# Altium schematic sheet 03-Power_3v3.SchDoc: ECE453 Power
size A; Date: 4/25/2017; ApprovedBy: JSK; CheckedBy: JSK; Author: JSK; CompanyName: University of Wisconsin; DrawnBy: JSK; Engineer: JSK; Organization: ECE 315; Address1: College of Engineering; Address2: 1415 Engineering Drive; Address3: Madison, WI 53706; Address4: ECE 453 Fall 2022; Revision: A; SheetNumber: 2; SheetTotal: 8; AssemblyNumber: ECE453-F22-01
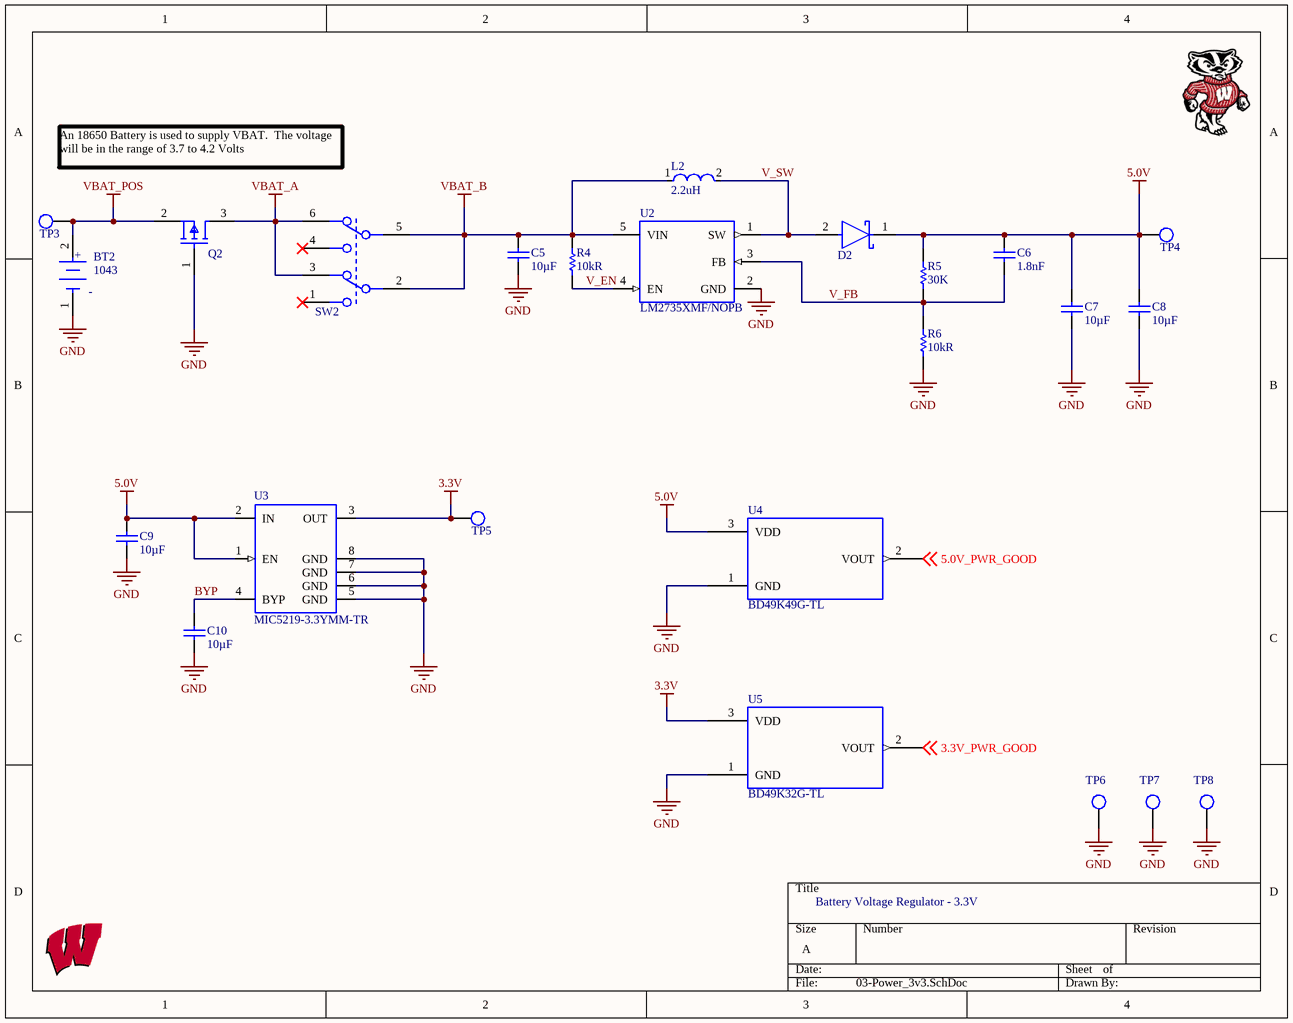
[diagram p0: 03-Power_3v3.SchDoc]

## Parts
BT2  1043  [Keystone_1043_0]
C5  value 10µF  [CAP_0805]  (hidden comment: CAP_0805_U_010_00)
C6  Capacitance: 1.8nF  [CAP_0805]  (hidden comment: CAP_0805_N_001_80)
C7  value 10µF  [CAP_0805]  (hidden comment: CAP_0805_U_010_00)
C8  value 10µF  [CAP_0805]  (hidden comment: CAP_0805_U_010_00)
C9  value 10µF  [CAP_0805]  (hidden comment: CAP_0805_U_010_00)
C10  value 10µF  [CAP_0805]  (hidden comment: CAP_0805_U_010_00)
D2  SM5817PL-TP  [On_Semiconductor_425-04_IPC_A]  (value not drawn)
L2  Inductance: 2.2uH  [IND_TAIYO_NRS4018_TAY]  (hidden comment: NRS4018T2R2MDGJ)
Q2  SSM3J328R,LF  [SOT-23_M]  (value not drawn)
R4  Resistance: 10kR  [RES_0805]  (hidden comment: RES_0805_K_010.00)
R5  30K  [RES_0805]
R6  Resistance: 10kR  [RES_0805]  (hidden comment: RES_0805_K_010.00)
SW2  JS202011SCQN  [C&K_Components_0_MFG]  (value not drawn)
TP3  TP_1206  [TP-SMC-1206]  (value not drawn)
TP4  TP_1206  [TP-SMC-1206]  (value not drawn)
TP5  TP_1206  [TP-SMC-1206]  (value not drawn)
TP6  TP_1206  [TP-SMC-1206]  (value not drawn)
TP7  TP_1206  [TP-SMC-1206]  (value not drawn)
TP8  TP_1206  [TP-SMC-1206]  (value not drawn)
U2  Manufacturer Part Number 1: LM2735XMF/NOPB  [Texas_Instruments_DBV0005A_0]  (hidden comment: LM2735XMF-NOPB)
U3  MIC5219-3.3YMM-TR  [MIC5219-3.3YMM-TR]
U4  BD49K49G-TL  [ROHM-SSOP3_ROM-M]
U5  BD49K32G-TL  [ROHM-SSOP3_ROM-M]

## Nets
3.3V: TP5.1 U3.3(OUT) U5.3(VDD)
5.0V: C6.2 C7.2 C8.2 C9.2 D2.1(C) R5.2 TP4.1 U3.1(EN) U3.2(IN) U4.3(VDD)
GND: BT2.1(C) C5.1 C7.1 C8.1 C9.1 C10.1 Q2.1(Gate) R6.1 TP6.1 TP7.1 TP8.1 U2.2(GND) U3.5(GND) U3.6(GND) U3.7(GND) U3.8(GND) U4.1(GND) U5.1(GND)
VBAT_A: Q2.3(Drain) SW2.3 SW2.6
VBAT_B: C5.2 L2.1 R4.2 SW2.2 SW2.5 U2.5(VIN)
VBAT_POS: BT2.2(A) Q2.2(Source) TP3.1
3.3V_PWR_GOOD: U5.2(VOUT) ; off-sheet 3.3V_PWR_GOOD
5.0V_PWR_GOOD: U4.2(VOUT) ; off-sheet 5.0V_PWR_GOOD
BYP: C10.2 U3.4(BYP)
V_EN: R4.1 U2.4(EN)
V_FB: C6.1 R5.1 R6.2 U2.3(FB)
V_SW: D2.2(A) L2.2 U2.1(SW)

Not connected (* = marked no-connect by the designer): SW2 1* 4*

## Notes on the sheet
- An 18650 Battery is used to supply VBAT.  The voltage will be in the range of 3.7 to 4.2 Volts
- Battery Voltage Regulator - 3.3V
- (in symbol 1043) +; -

## Library data of the parts
BT2 = 1043: Cylindrical Battery Contacts, Clips, Holders & Springs 18650 PCB PLASTIC BATT HLDR THM 1 CELL; Manufacturer 1: Keystone Electronics; Body Material: Nylon; Number of Cells: 1; Supplier 1: Digi-Key; Supplier Part Number 1: 36-1043-ND; RoHS: Yes; Category: Passive Components; Stock 1: 3564; Pricing 1: 1=3.00000, 25=2.52400, 100=2.08850, 250=1.92020, 500=1.80144 (USD); Mount: Through Hole,PCB; Number of Pins: 1; Contact Plating: Gold; Material: Nylon; Contact Material: Stainless Steel; Min Operating Temperature: -50°C; Max Operating Temperature: 145°C; Package Quantity: 100; Packaging: Tray; Termination: PC Pin; ComponentLink1URL: https://datasheet.ciiva.com/4/1043-4710.pdf?src-supplier=Digi-Key; ComponentLink1Description: https://datasheet.ciiva.com/4/1043-4710.pdf?src-supplier=Digi-Key; ComponentLink2URL: https://datasheet.ciiva.com/3353/1043-eng-tds-3353208.pdf?src-supplier=Distrelec; ComponentLink2Description: https://datasheet.ciiva.com/3353/1043-eng-tds-3353208.pdf?src-supplier=Distrelec; ComponentLink3URL: https://datasheet.ciiva.com/41803/1043-41803215.pdf?src-supplier=Digi-Key; ComponentLink3Description: https://datasheet.ciiva.com/41803/1043-41803215.pdf?src-supplier=Digi-Key; ComponentLink4URL: https://datasheet.ciiva.com/4642/1043-4642493.pdf?src-supplier=Mouser; ComponentLink4Description: https://datasheet.ciiva.com/4642/1043-4642493.pdf?src-supplier=Mouser; Manufacturer Part Number 1: 1043
C5 C7-C10 = CAP_0805_U_010_00: CAP CER 10UF 10V X5R 0805; Manufacturer: Samsung Electro-Mechanics America, Inc.; Manufacturer Part Number: CL21A106KPCLQNC; Tolerance: ±10%; Supplier 1: Digi-Key; Supplier Part Number 1: 1276-2402-1-ND; RoHS: RoHS Compliant; Category: Capacitors; Stock 1: 97192; Pricing 1: 1=0.2, 10=0.14, 25=0.1052, 50=0.0806, 100=0.0665, 500=0.0469, 1000=0.0385 (USD); Packaging: Cut Tape (CT); Voltage - Rated: 10V; Temperature Coefficient: X5R; Mounting Type: Surface Mount, MLCC; Operating Temperature: -55°C ~ 85°C; Applications: General Purpose; Ratings: -; Package / Case: 0805 (2012 Metric); Size / Dimension: 0.079" L x 0.049" W (2.00mm x 1.25mm); Height - Seated (Max): -; Thickness (Max): 0.037" (0.95mm); Lead Spacing: -; Features: -; Lead Style: -; ComponentLink1URL: http://media.digikey.com/pdf/Data%20Sheets/Samsung%20PDFs/CL21A106KPCLQNC_character.pdf; ComponentLink1Description: http://media.digikey.com/pdf/Data%20Sheets/Samsung%20PDFs/CL21A106KPCLQNC_character.pdf
C6 = CAP_0805_N_001_80: MURATA - GRM2165C1H182JA01D - SMD Multilayer Ceramic Capacitor, 1800 pF, 50 V, 0805 [2012 Metric], ± 5%, C0G / NP0, GRM Series; Voltage Rating: 50V; Temperature Coefficient: 30ppm/°C; ComponentLink3URL: https://datasheet.ciiva.com/26920/getdatasheetpartid-355170-26920201.pdf; ComponentLink3Description: https://datasheet.ciiva.com/26920/getdatasheetpartid-355170-26920201.pdf; ComponentLink1URL: https://datasheet.ciiva.com/25730/cl21a106kpclqnc-25730594.pdf; ComponentLink1Description: https://datasheet.ciiva.com/25730/cl21a106kpclqnc-25730594.pdf; Supplier 1: Digi-Key; Supplier Part Number 1: 490-1626-1-ND; Manufacturer 1: Murata; Manufacturer Part Number 1: GRM2165C1H182JA01D; RoHS: Yes; Category: Ceramic Capacitors; Stock 1: 44565; Pricing 1: 1=0.20000, 10=0.14000, 50=0.08380, 100=0.07080, 500=0.04844, 1000=0.04285 (USD); Mount: Surface Mount; Case/Package: 0805; Case Code (Metric): 2012; Case Code (Imperial): 0805; Min Operating Temperature: -55°C; Max Operating Temperature: 125°C; Tolerance: 5%; Package Quantity: 1; Packaging: Tape and Reel; Voltage Rating (DC): 50V; Dielectric: C0G; Termination: SMD/SMT; Voltage: 50V; Series: GRM; Construction: Flat; Length: 2mm; Width: 0.049inch; Height: 0.6mm; Thickness: 0.028inch; Depth: 1.25mm; Radiation Hardening: No; REACH SVHC: No SVHC; Lead Free: Lead Free; RoHS Compliant: Yes; ComponentLink2URL: https://datasheet.ciiva.com/134/partnumbering-e-01-134098.pdf?src-supplier=Digi-Key; ComponentLink2Description: https://datasheet.ciiva.com/134/partnumbering-e-01-134098.pdf?src-supplier=Digi-Key; ComponentLink4URL: https://datasheet.ciiva.com/134/partnumbering-e-01-134100.pdf?src-supplier=Digi-Key; ComponentLink4Description: https://datasheet.ciiva.com/134/partnumbering-e-01-134100.pdf?src-supplier=Digi-Key; ComponentLink5URL: https://datasheet.ciiva.com/134/partnumbering-e-01-134099.pdf?src-supplier=Digi-Key; ComponentLink5Description: https://datasheet.ciiva.com/134/partnumbering-e-01-134099.pdf?src-supplier=Digi-Key
D2 = SM5817PL-TP: DIODE SCHOTTKY 20V 1A SOD123FL; Forward Voltage: 450mV; Max Surge Current: 30A; Element Configuration: Single; Manufacturer 2: MCC; Manufacturer Part Number 2: SM5817PL-TP; RoHS: Yes; Category: Rectifier Diodes; Stock 2: 178040; Pricing 2: 1=0.46000, 10=0.31900, 100=0.16110, 500=0.13144, 1000=0.09752 (USD); Mount: Surface Mount; Number of Pins: 2; Min Operating Temperature: -65°C; Max Operating Temperature: 125°C; Packaging: Tape and Reel; Package Quantity: 1; Average Rectified Current: 1A; Peak Non-Repetitive Surge Current: 30A; Max Reverse Voltage (DC): 20V; Reverse Voltage: 20V; Radiation Hardening: No; RoHS Compliant: Yes; ComponentLink1URL: https://datasheet.ciiva.com/15200/getdatasheetpartid-487494-15200581.pdf?src-supplier=Verical; ComponentLink1Description: https://datasheet.ciiva.com/15200/getdatasheetpartid-487494-15200581.pdf?src-supplier=Verical; ComponentLink2URL: https://datasheet.ciiva.com/912/sm5817pl-sm5819plsod-123fl-912827.pdf?src-supplier=Digi-Key; ComponentLink2Description: https://datasheet.ciiva.com/912/sm5817pl-sm5819plsod-123fl-912827.pdf?src-supplier=Digi-Key; Supplier 1: Digi-Key; Supplier Part Number 1: SM5817PL-TPMSCT-ND
L2 = NRS4018T2R2MDGJ: Inductor Power Shielded Wirewound 2.2uH 20% 100KHz Ferrite 2.2A 0.0504Ohm DCR 1515 T/R; Manufacturer 1: Taiyo Yuden; Self Resonant Frequency: 60MHz; DC Resistance (DCR): 50.4mR; Max DC Current: 3A; ComponentLink1URL: https://datasheet.ciiva.com/8502/nr6028t2r2n-ss-8502679.pdf?src-supplier=Avnet; ComponentLink1Description: https://datasheet.ciiva.com/8502/nr6028t2r2n-ss-8502679.pdf?src-supplier=Avnet; ComponentLink2URL: https://datasheet.ciiva.com/15988/8nr6028t2r2n-15988110.pdf?src-supplier=Onlinecomponents.com; ComponentLink2Description: https://datasheet.ciiva.com/15988/8nr6028t2r2n-15988110.pdf?src-supplier=Onlinecomponents.com; ComponentLink3URL: https://datasheet.ciiva.com/7291/nr6028t2r2n-ss-7291637.pdf?src-supplier=Newark; ComponentLink3Description: https://datasheet.ciiva.com/7291/nr6028t2r2n-ss-7291637.pdf?src-supplier=Newark; ComponentLink4URL: https://datasheet.ciiva.com/1043/wound04-e-1043090.pdf?src-supplier=Digi-Key; ComponentLink4Description: https://datasheet.ciiva.com/1043/wound04-e-1043090.pdf?src-supplier=Digi-Key; ComponentLink5URL: https://datasheet.ciiva.com/1043/wound04-e-1043091.pdf?src-supplier=Digi-Key; ComponentLink5Description: https://datasheet.ciiva.com/1043/wound04-e-1043091.pdf?src-supplier=Digi-Key; ComponentLink6URL: https://datasheet.ciiva.com/1043/wound04-e-1043092.pdf?src-supplier=Digi-Key; ComponentLink6Description: https://datasheet.ciiva.com/1043/wound04-e-1043092.pdf?src-supplier=Digi-Key; Supplier 1: Digi-Key; Supplier Part Number 1: 587-2890-1-ND; Manufacturer Part Number 1: NRS4018T2R2MDGJ; RoHS: Yes; Category: Fixed Inductors; Stock 1: 291635; Pricing 1: 1=0.27000, 10=0.23800, 25=0.20840, 50=0.17860, 100=0.16370, 250=0.14884, 500=0.13990, 1000=0.10716 (USD); Mount: Surface Mount; Case/Package: Nonstandard; Number of Pins: 2; Core Material: Ferrite; Min Operating Temperature: -25°C; Max Operating Temperature: 125°C; Packaging: Tape and Reel; Tolerance: 20%; Package Quantity: 3500; Current Rating: 2.2A; Saturation Current: 3A; Shielding: Shielded; Resistor Type: Wirewound; Test Frequency: 100kHz; Termination: SMD/SMT; Inductance Tolerance: 20%; RMS Current (Irms): 2.2A; Series: NRS; Length: 4mm; Width: 0.157inch; Height: 1.8mm; Height - Seated (Max): 0.071inch; Depth: 4.2mm; Lead Pitch: 2.8mm; Radiation Hardening: No; Halogen Free: Halogen Free; Lead Free: Lead Free; RoHS Compliant: Yes; REACH SVHC: Unknown; ComponentLink7URL: https://datasheet.ciiva.com/8502/nrs4018t2r2mdgj-ss-8502646.pdf?src-supplier=Avnet; ComponentLink7Description: https://datasheet.ciiva.com/8502/nrs4018t2r2mdgj-ss-8502646.pdf?src-supplier=Avnet; ComponentLink8URL: https://datasheet.ciiva.com/7291/nrs4018t2r2mdgj-ss-7291680.pdf?src-supplier=Newark; ComponentLink8Description: https://datasheet.ciiva.com/7291/nrs4018t2r2mdgj-ss-7291680.pdf?src-supplier=Newark; ComponentLink9URL: https://datasheet.ciiva.com/25607/0900766b810b3cd2-25607949.pdf?src-supplier=RSComponents; ComponentLink9Description: https://datasheet.ciiva.com/25607/0900766b810b3cd2-25607949.pdf?src-supplier=RSComponents
Q2 = SSM3J328R,LF: MOSFET P-CH 20V 6A SOT23F; Manufacturer 1: Toshiba; Rds On Max: 29.8mR; Input Capacitance: 840pF; Max Power Dissipation: 1W; Gate to Source Voltage (Vgs): 8V; Turn-Off Delay Time: 107ns; Turn-On Delay Time: 32ns; Number of Channels: 1; Drain to Source Resistance: 47.4mR; Power Dissipation: 2W; Element Configuration: Single; Drain to Source Breakdown Voltage: -20V; Polarity: P-CHANNEL; Supplier 1: Digi-Key; Supplier Part Number 1: SSM3J328RLFCT-ND; Manufacturer Part Number 1: SSM3J328R,LF; RoHS: Yes; Category: MOSFETs; Stock 1: 476474; Pricing 1: 1=0.43000, 10=0.32200, 25=0.29040, 100=0.20060, 500=0.13728, 1000=0.10560 (USD); Mount: Surface Mount; Case/Package: SOT-23-3; Number of Pins: 3; Min Operating Temperature: -55°C; Max Operating Temperature: 150°C; Package Quantity: 3000; Packaging: Tape and Reel; Drain to Source Voltage (Vdss): 20V; Continuous Drain Current (ID): 6A; Number of Elements: 1; Radiation Hardening: No; RoHS Compliant: Yes; ComponentLink1URL: https://datasheet.ciiva.com/11158/ssm3j328r-datasheet-en-20140301-11158652.pdf?src-supplier=Avnet; ComponentLink1Description: https://datasheet.ciiva.com/11158/ssm3j328r-datasheet-en-20140301-11158652.pdf?src-supplier=Avnet; ComponentLink2URL: https://datasheet.ciiva.com/24106/ssm3j328r-datasheet-en-20140301-24106699.pdf?src-supplier=Mouser; ComponentLink2Description: https://datasheet.ciiva.com/24106/ssm3j328r-datasheet-en-20140301-24106699.pdf?src-supplier=Mouser; ComponentLink3URL: https://datasheet.ciiva.com/45425/ssm3j328r-datasheet-en-20140301-45425519.pdf?src-supplier=Digi-Key; ComponentLink3Description: https://datasheet.ciiva.com/45425/ssm3j328r-datasheet-en-20140301-45425519.pdf?src-supplier=Digi-Key; ComponentLink4URL: https://datasheet.ciiva.com/45425/ssm3j328r-datasheet-en-20140301-45425813.pdf?src-supplier=Digi-Key; ComponentLink4Description: https://datasheet.ciiva.com/45425/ssm3j328r-datasheet-en-20140301-45425813.pdf?src-supplier=Digi-Key
R4 R6 = RES_0805_K_010.00: RES SMD 10K OHM 1% 1/8W 0805; Manufacturer 1: Yageo; Manufacturer Part Number 1: RC0805FR-0710KL; Temperature Coefficient: 100ppm/°C; Power Rating: 125mW; Voltage Rating: 150V; Supplier 1: Digi-Key; Supplier Part Number 1: 311-10.0KCRCT-ND; Stock 1: 7562122; Pricing 1: 1=0.10000, 10=0.04200, 100=0.01690, 1000=0.00759, 2500=0.00659 (USD); RoHS: Yes; Case/Package: 0805; Case Code (Imperial): 0805; Case Code (Metric): 2012; Min Operating Temperature: -55°C; Max Operating Temperature: 155°C; Tolerance: 1%; Packaging: Tape and Reel; Features: Moisture Resistant; Termination: SMD/SMT; Number of Terminations: 2; Military Standard: Not; Max Power Dissipation: 125mW; Package Quantity: 1; Length: 2mm; Height: 0.024inch; Width: 0.049inch; Depth: 1.25mm; Lead Free: Lead Free; REACH SVHC: Unknown; ComponentLink1URL: https://datasheet.ciiva.com/11808/0900766b8106beab-11808151.pdf?src-supplier=RSComponents; ComponentLink1Description: https://datasheet.ciiva.com/11808/0900766b8106beab-11808151.pdf?src-supplier=RSComponents; ComponentLink2URL: https://datasheet.ciiva.com/12669/rc0805-12669688.pdf?src-supplier=Mouser; ComponentLink2Description: https://datasheet.ciiva.com/12669/rc0805-12669688.pdf?src-supplier=Mouser; ComponentLink3URL: https://datasheet.ciiva.com/46447/444164-46447563.pdf?src-supplier=Element14; ComponentLink3Description: https://datasheet.ciiva.com/46447/444164-46447563.pdf?src-supplier=Element14; ComponentLink4URL: https://datasheet.ciiva.com/2456/pyu-r-int-thick-7-2456972.pdf?src-supplier=Digi-Key; ComponentLink4Description: https://datasheet.ciiva.com/2456/pyu-r-int-thick-7-2456972.pdf?src-supplier=Digi-Key; ComponentLink5URL: https://datasheet.ciiva.com/2456/pyu-r-int-thick-7-2456973.pdf?src-supplier=Digi-Key; ComponentLink5Description: https://datasheet.ciiva.com/2456/pyu-r-int-thick-7-2456973.pdf?src-supplier=Digi-Key; ComponentLink6URL: https://datasheet.ciiva.com/2456/pyu-r-int-thick-7-2456974.pdf?src-supplier=Digi-Key; ComponentLink6Description: https://datasheet.ciiva.com/2456/pyu-r-int-thick-7-2456974.pdf?src-supplier=Digi-Key; ComponentLink7URL: https://datasheet.ciiva.com/16747/rc0805-16747087.pdf?src-supplier=Future+Electronics; ComponentLink7Description: https://datasheet.ciiva.com/16747/rc0805-16747087.pdf?src-supplier=Future+Electronics; Category: Chip SMD Resistors; Size Code: 0805; Resistor Type: Thick Film; Series: RC; Construction: Rectangular; Resistance Tolerance: 1%; Technology: THICK FILM; RoHS Compliant: Yes
R5 = RES_0805_K_030.00: Res Thick Film 0805 30K Ohm 1% 0.125W(1/8W) ±100ppm/°C Pad SMD Automotive T/R; Manufacturer 1: Panasonic; Manufacturer Part Number 1: ERJ-6ENF3002V; Power Rating: 125mW; Voltage Rating: 150V; Supplier 1: Digi-Key; Supplier Part Number 1: P30.0KCCT-ND; RoHS: Yes; Category: Chip SMD Resistors; Stock 1: 296893; Pricing 1: 1=0.10000, 10=0.07500, 100=0.02880, 1000=0.01265, 2500=0.01092 (USD); Mount: Surface Mount; Case/Package: 0805; Case Code (Metric): 2012; Case Code (Imperial): 0805; Contact Plating: Tin; Weight: 0.000194oz; Min Operating Temperature: -55°C; Max Operating Temperature: 155°C; Tolerance: 1%; Packaging: Tape and Reel; Package Quantity: 1; Resistor Type: Thick Film; Number of Terminations: 2; Termination: SMD/SMT; Temperature Coefficient: 100ppm/°C; Max Power Dissipation: 125mW; Voltage Rating (DC): 150V; Features: Automotive AEC-Q200; Series: ERJ; Technology: THICK FILM; Resistance Tolerance: 1%; Construction: Rectangular; Length: 2mm; Width: 0.049inch; Height: 0.6mm; Depth: 1.25mm; Radiation Hardening: No; REACH SVHC: Unknown; Military Standard: Not; Lead Free: Lead Free; RoHS Compliant: Yes; ComponentLink1URL: https://datasheet.ciiva.com/11821/0900766b80f80784-11821600.pdf?src-supplier=RSComponents; ComponentLink1Description: https://datasheet.ciiva.com/11821/0900766b80f80784-11821600.pdf?src-supplier=RSComponents; ComponentLink2URL: https://datasheet.ciiva.com/9117/aoa0000ce2-9117485.pdf?src-supplier=Avnet; ComponentLink2Description: https://datasheet.ciiva.com/9117/aoa0000ce2-9117485.pdf?src-supplier=Avnet; ComponentLink3URL: https://datasheet.ciiva.com/24124/aoa0000ce2-24124393.pdf?src-supplier=Mouser; ComponentLink3Description: https://datasheet.ciiva.com/24124/aoa0000ce2-24124393.pdf?src-supplier=Mouser; ComponentLink4URL: https://datasheet.ciiva.com/30169/aoa0000ce2-30169447.pdf?src-supplier=Onlinecomponents.com; ComponentLink4Description: https://datasheet.ciiva.com/30169/aoa0000ce2-30169447.pdf?src-supplier=Onlinecomponents.com; ComponentLink5URL: https://datasheet.ciiva.com/17210/aoa0000ce2-17210478.pdf?src-supplier=Avnet+Europe; ComponentLink5Description: https://datasheet.ciiva.com/17210/aoa0000ce2-17210478.pdf?src-supplier=Avnet+Europe; ComponentLink6URL: https://datasheet.ciiva.com/22673/1678782-22673293.pdf?src-supplier=Element14; ComponentLink6Description: https://datasheet.ciiva.com/22673/1678782-22673293.pdf?src-supplier=Element14; ComponentLink7URL: https://datasheet.ciiva.com/28565/1694929-28565193.pdf?src-supplier=Element14; ComponentLink7Description: https://datasheet.ciiva.com/28565/1694929-28565193.pdf?src-supplier=Element14; ComponentLink8URL: https://datasheet.ciiva.com/46441/1678782-46441405.pdf?src-supplier=Element14; ComponentLink8Description: https://datasheet.ciiva.com/46441/1678782-46441405.pdf?src-supplier=Element14; ComponentLink9URL: https://datasheet.ciiva.com/46441/1678782-46441406.pdf?src-supplier=Element14; ComponentLink9Description: https://datasheet.ciiva.com/46441/1678782-46441406.pdf?src-supplier=Element14; ComponentLink10URL: https://datasheet.ciiva.com/16512/aoa0000ce2-16512236.pdf?src-supplier=Avnet+Asia; ComponentLink10Description: https://datasheet.ciiva.com/16512/aoa0000ce2-16512236.pdf?src-supplier=Avnet+Asia; ComponentLink11URL: https://datasheet.ciiva.com/7711/1678782-7711062.pdf?src-supplier=Element14; ComponentLink11Description: https://datasheet.ciiva.com/7711/1678782-7711062.pdf?src-supplier=Element14; Resistance: 30K
SW2 = JS202011SCQN: C & K COMPONENTS - JS202011SCQN - SWITCH, DPDT, 0.6A, 6VDC, SMD; Manufacturer 1: ITT C&K; Actuator Material: Nylon,Polyamide,PA46; Actuator Color: Black; Voltage Rating (DC): 6V; Current Rating: 300mA; Electrical Life: 5000Cycles; Switch Function: On-On; Contact Resistance: 70mR; Switch Travel: 2mm; Actuator Type: Standard; Supplier 1: Digi-Key; Supplier Part Number 1: 401-2002-1-ND; Manufacturer Part Number 1: JS202011SCQN; RoHS: Yes; Category: Slide Switches; Stock 1: 21096; Pricing 1: 1=0.55000, 10=0.53000, 25=0.51040, 100=0.44180, 250=0.40252, 500=0.37306 (USD); Mount: Surface Mount; Contact Plating: Silver; Contact Material: Copper Alloy; Housing Material: Nylon; Min Operating Temperature: -20°C; Max Operating Temperature: 85°C; Throw Configuration: DPDT; Packaging: Tape and Reel; Package Quantity: 1; Termination: Gull Wing; Max Voltage Rating (DC): 6V; Series: JS; Max Current Rating: 300mA; Contact Current Rating: 300mA; Orientation: Vertical; Length: 9mm; Depth: 7.5mm; Actuator Length: 2mm; Radiation Hardening: No; REACH SVHC: No SVHC; Lead Free: Lead Free; Flammability Rating: UL94 V-2; ComponentLink1URL: https://datasheet.ciiva.com/2889/js-29aug13-2889127.pdf?src-supplier=Digi-Key; ComponentLink1Description: https://datasheet.ciiva.com/2889/js-29aug13-2889127.pdf?src-supplier=Digi-Key; ComponentLink2URL: https://datasheet.ciiva.com/23829/1707718-23829488.pdf?src-supplier=Newark; ComponentLink2Description: https://datasheet.ciiva.com/23829/1707718-23829488.pdf?src-supplier=Newark; ComponentLink3URL: https://datasheet.ciiva.com/8625/js-9dec14-8625470.pdf?src-supplier=Avnet; ComponentLink3Description: https://datasheet.ciiva.com/8625/js-9dec14-8625470.pdf?src-supplier=Avnet; ComponentLink4URL: https://datasheet.ciiva.com/2889/js-15sept15-2889128.pdf?src-supplier=Digi-Key; ComponentLink4Description: https://datasheet.ciiva.com/2889/js-15sept15-2889128.pdf?src-supplier=Digi-Key; ComponentLink5URL: https://datasheet.ciiva.com/2889/js-15sept15-2889129.pdf?src-supplier=Digi-Key; ComponentLink5Description: https://datasheet.ciiva.com/2889/js-15sept15-2889129.pdf?src-supplier=Digi-Key; ComponentLink6URL: https://datasheet.ciiva.com/22630/1707718-22630697.pdf?src-supplier=Element14; ComponentLink6Description: https://datasheet.ciiva.com/22630/1707718-22630697.pdf?src-supplier=Element14
TP3-TP8 = TP_1206: Test Point SMD 1206; Manufacturer: TE Connectivity (Tyco Electronics); Manufacturer Part Number: 1625854-1; Resistance Value: 0 Ohm; Temperature Coefficient: N/R; Supplier: Digi-Key; Stock 1: 31937; Pricing 1: 1=0.28, 10=0.261, 25=0.224, 50=0.1902, 100=0.1828, 250=0.1641, 500=0.1567, 1000=0.1306 (USD); Case Size: 1206; Dimension: 3.2 x 1.6 x 1.25mm; Family: RC; Mounting: Surface Mount; Operating Temperature: -55 to 125 C; Part No: 1625854-1; RoHS: Yes; Packaging: Tape and Reel; Termination Style: N/R; Terminal Pitch: N/R; Power Rating: N/R; Tolerance: N/R; ComponentLink1URL: https://datasheet.ciiva.com/6439/eng-ds-1773266-a-6439169.pdf; ComponentLink1Description: https://datasheet.ciiva.com/6439/eng-ds-1773266-a-6439169.pdf; ComponentLink2URL: https://datasheet.ciiva.com/30136/1773266-a-30136341.pdf; ComponentLink2Description: https://datasheet.ciiva.com/30136/1773266-a-30136341.pdf; ComponentLink3URL: https://datasheet.ciiva.com/6439/eng-ds-1773266-a-6439080.pdf; ComponentLink3Description: https://datasheet.ciiva.com/6439/eng-ds-1773266-a-6439080.pdf; ComponentLink4URL: https://datasheet.ciiva.com/6439/eng-ds-1773266-a-6439081.pdf; ComponentLink4Description: https://datasheet.ciiva.com/6439/eng-ds-1773266-a-6439081.pdf; ComponentLink5URL: https://datasheet.ciiva.com/6439/eng-ds-1773266-a-6439083.pdf; ComponentLink5Description: https://datasheet.ciiva.com/6439/eng-ds-1773266-a-6439083.pdf; Supplier Part Number: A106143CT-ND
U2 = LM2735XMF-NOPB: IC REG MULT CONFG ADJ 2.1A SOT23; Manufacturer 1: TI National Semiconductor; Max Input Voltage: 5.5V; Max Output Current: 3A; Min Supply Voltage: 2.7V; Output Voltage: 24V; Switching Frequency: 1.6MHz; Nominal Supply Current: 500uA; Efficiency: 90%; Number of Outputs: 1; Synchronous Rectifier: No; Min Output Voltage: 3V; Quiescent Current: 7mA; Topology: Boost,SEPIC; Output Type: Adjustable; Supplier 1: Digi-Key; Supplier Part Number 1: LM2735XMF/NOPBCT-ND; RoHS: Yes; Category: Voltage Regulators - Switching; Stock 1: 5135; Pricing 1: 1=2.27000, 10=2.03900, 25=1.92400, 100=1.63920, 250=1.53912, 500=1.34672 (USD); Mount: Surface Mount; Case/Package: SOT-23; Number of Pins: 5; Contact Plating: Tin,Matte; Min Operating Temperature: -40°C; Max Operating Temperature: 125°C; Output Current: 3A; Min Input Voltage: 2.7V; Packaging: Tape and Reel; Package Quantity: 1000; Max Output Voltage: 24V; Operating Supply Voltage: 5.5V; Series: LM2735; Supply Current: 500uA; Length: 2.92mm; Width: 1.6mm; Height: 1.02mm; Radiation Hardening: No; REACH SVHC: No SVHC; Lead Free: Lead Free; RoHS Compliant: Yes; ComponentLink1URL: https://datasheet.ciiva.com/22669/1802021-22669478.pdf?src-supplier=Element14; ComponentLink1Description: https://datasheet.ciiva.com/22669/1802021-22669478.pdf?src-supplier=Element14; ComponentLink2URL: https://datasheet.ciiva.com/3220/lm2735-3220073.pdf?src-supplier=Avnet; ComponentLink2Description: https://datasheet.ciiva.com/3220/lm2735-3220073.pdf?src-supplier=Avnet; ComponentLink3URL: https://datasheet.ciiva.com/3221/lm2735-3221644.pdf?src-supplier=Avnet; ComponentLink3Description: https://datasheet.ciiva.com/3221/lm2735-3221644.pdf?src-supplier=Avnet; ComponentLink4URL: https://datasheet.ciiva.com/6579/lm2735-6579929.pdf?src-supplier=Digi-Key; ComponentLink4Description: https://datasheet.ciiva.com/6579/lm2735-6579929.pdf?src-supplier=Digi-Key; ComponentLink5URL: https://datasheet.ciiva.com/6579/lm2735-6579933.pdf?src-supplier=Digi-Key; ComponentLink5Description: https://datasheet.ciiva.com/6579/lm2735-6579933.pdf?src-supplier=Digi-Key; ComponentLink6URL: https://datasheet.ciiva.com/6579/lm2735-6579935.pdf?src-supplier=Digi-Key; ComponentLink6Description: https://datasheet.ciiva.com/6579/lm2735-6579935.pdf?src-supplier=Digi-Key; ComponentLink7URL: https://datasheet.ciiva.com/15223/getdatasheetpartid-142075-15223063.pdf?src-supplier=Verical; ComponentLink7Description: https://datasheet.ciiva.com/15223/getdatasheetpartid-142075-15223063.pdf?src-supplier=Verical
U3 = MIC5219-3.3YMM-TR: MIC5219 Series 500 mA 3.3 V Fixed Output Surface Mount LDO Regulator- MSOP-8 T/R; Manufacturer 1: Microchip; Max Input Voltage: 12V; Min Input Voltage: 2.5V; Max Output Current: 500mA; Dropout Voltage: 350mV; Output Voltage: 3.3V; Number of Regulators: 1; Output Configuration: Positive; Quiescent Current: 8uA; Power Supply Rejection Ratio (PSRR): 75dB; Supplier 1: Digi-Key; Supplier Part Number 1: MIC5219-3.3YMM-CT-ND; Manufacturer Part Number 1: MIC5219-3.3YMM-TR; RoHS: Yes; Category: Voltage Regulators - Linear; Stock 1: 9852; Pricing 1: 1=1.57000, 25=1.31440, 100=1.21500 (USD); Mount: Surface Mount; Case/Package: MSOP; Number of Pins: 8; Min Operating Temperature: -40°C; Max Operating Temperature: 125°C; Package Quantity: 2500; Packaging: Tape and Reel; Output Current: 500mA; Min Output Voltage: 3.3V; Output Type: Fixed; Series: -; RoHS Compliant: Yes; ComponentLink1URL: https://datasheet.ciiva.com/16466/mic5219-16466762.pdf?src-supplier=Future+Electronics; ComponentLink1Description: https://datasheet.ciiva.com/16466/mic5219-16466762.pdf?src-supplier=Future+Electronics; ComponentLink2URL: https://datasheet.ciiva.com/2063/mic5219-2063524.pdf?src-supplier=Digi-Key; ComponentLink2Description: https://datasheet.ciiva.com/2063/mic5219-2063524.pdf?src-supplier=Digi-Key
U4 = BD49K49G-TL: Processor Supervisor 4.9V 1 Active Low/CMOS 3-Pin SSOP T/R; Mfr_Name: ROHM Semiconductor; Manufacturer 1: Rohm; Number of Voltages Monitored: 1; Copyright: Copyright (C) 2022 Ultra Librarian. All rights reserved.; Manufacturer_Part_Number: BD49K49G-TL; Digi-Key_Part_Number_1: BD49K49G-TLTR-ND; Digi-Key_Part_Number_2: BD49K49G-TLCT-ND; Digi-Key_Part_Number_3: BD49K49G-TLDKR-ND; RefDes: RefDes; Type: DEV; Supplier 1: Digi-Key; Supplier Part Number 1: BD49K49G-TLCT-ND; Manufacturer Part Number 1: BD49K49G-TL; RoHS: Yes; Category: Voltage Supervisors; Stock 1: 2958; Pricing 1: 1=0.37000, 10=0.29900, 25=0.27360, 100=0.20350, 250=0.18444, 500=0.15264, 1000=0.11448 (USD); Mount: Surface Mount; Case/Package: TO-236-3; Min Operating Temperature: -40°C; Max Operating Temperature: 105°C; Reset: Active Low; Packaging: Tape and Reel; Threshold Voltage: 4.9V; RoHS Compliant: Yes; ComponentLink1URL: https://www.rohm.com/datasheet/BD48K32G/bd48xxg-e?src-supplier=Digi-Key; ComponentLink1Description: https://www.rohm.com/datasheet/BD48K32G/bd48xxg-e?src-supplier=Digi-Key
U5 = BD49K32G-TL: Processor Supervisor 3.2V 1 Active Low/CMOS 3-Pin SSOP T/R; Manufacturer 1: Rohm; Number of Voltages Monitored: 1; ComponentLink1URL: https://www.rohm.com/datasheet/BD48K32G/bd48xxg-e?src-supplier=Digi-Key; ComponentLink1Description: https://www.rohm.com/datasheet/BD48K32G/bd48xxg-e?src-supplier=Digi-Key; Stock 2: 4461; Pricing 2: 1=0.37000, 10=0.29900, 25=0.27360, 100=0.20350, 250=0.18444, 500=0.15264, 1000=0.11448 (USD); Lead Free: Lead Free; Supplier 1: Digi-Key; Supplier Part Number 1: BD49K32G-TLCT-ND; Manufacturer Part Number 1: BD49K32G-TL; RoHS: Yes; Category: Voltage Supervisors; Stock 1: 4461; Pricing 1: 1=0.37000, 10=0.29900, 25=0.27360, 100=0.20350, 250=0.18444, 500=0.15264, 1000=0.11448 (USD); Mount: Surface Mount; Case/Package: TO-236-3; Min Operating Temperature: -40°C; Max Operating Temperature: 105°C; Type: Voltage Detector; Reset: Active Low; Packaging: Cut Tape; Threshold Voltage: 3.2V; RoHS Compliant: Yes